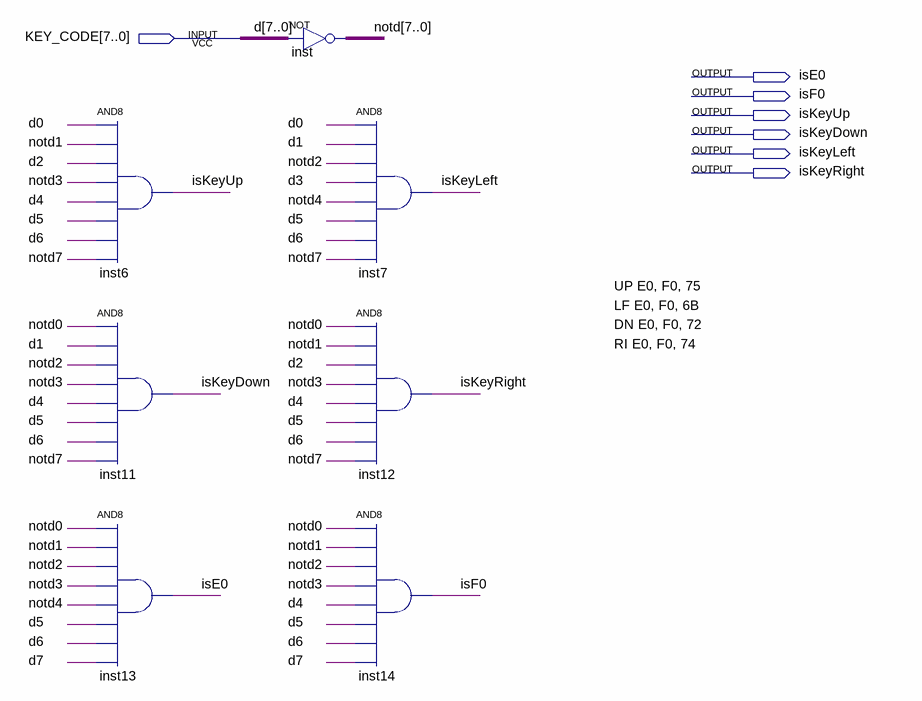
[diagram p0: schematic sheet]
// Quartus schematic KEY_DETECTOR.bdf as structural Verilog: 7 symbols, 7 pins
module KEY_DETECTOR (
  input  [7:0] KEY_CODE,
  output isE0,
  output isF0,
  output isKeyUp,
  output isKeyDown,
  output isKeyLeft,
  output isKeyRight
);

  wire [7:0] notd;

  and inst6 (isKeyUp, KEY_CODE[0], notd[1], KEY_CODE[2], notd[3], KEY_CODE[4], KEY_CODE[5], KEY_CODE[6], notd[7]);
  and inst11 (isKeyDown, notd[0], KEY_CODE[1], notd[2], notd[3], KEY_CODE[4], KEY_CODE[5], KEY_CODE[6], notd[7]);
  and inst13 (isE0, notd[0], notd[1], notd[2], notd[3], notd[4], KEY_CODE[5], KEY_CODE[6], KEY_CODE[7]);
  assign notd = ~KEY_CODE;  // NOT inst, 8 bits wide
  and inst7 (isKeyLeft, KEY_CODE[0], KEY_CODE[1], notd[2], KEY_CODE[3], notd[4], KEY_CODE[5], KEY_CODE[6], notd[7]);
  and inst12 (isKeyRight, notd[0], notd[1], KEY_CODE[2], notd[3], KEY_CODE[4], KEY_CODE[5], KEY_CODE[6], notd[7]);
  and inst14 (isF0, notd[0], notd[1], notd[2], notd[3], KEY_CODE[4], KEY_CODE[5], KEY_CODE[6], KEY_CODE[7]);

  // Other names for the same wires on the sheet: d[7:0] = KEY_CODE; d0 = KEY_CODE[0]; d1 = KEY_CODE[1];
  //   d2 = KEY_CODE[2]; d3 = KEY_CODE[3]; d4 = KEY_CODE[4]; d5 = KEY_CODE[5]; d6 = KEY_CODE[6]; d7 = KEY_CODE[7]

  // Notes on the sheet:
  //   UP E0, F0, 75
  //   LF E0, F0, 6B
  //   DN E0, F0, 72
  //   RI E0, F0, 74
endmodule
